# Altium schematic sheet PCI_Express.SchDoc: Ixora
size A3; Organization: Toradex AG; Address1: Altsagenstrasse 5; Address2: Horw; Address3: 6048; Address4: Switzerland; DocumentNumber: 18; Revision: V1.1; SheetNumber: 14; SheetTotal: 17; PageSetup: Record=PageOptions|CenterHorizontal=True|CenterVertical=True|PrintScale=0.73|XCorrection=1.00|YCorrection=1.00|PrintKind=0|BorderSize=5000000|LeftOffset=0|BottomOffset=0|Orientation=2|PaperLength=1000|PaperWidth=1000|Scale=100|PaperSource=7|PrintQuality=-4|MediaType=1|DitherType=10|PaperKind=A4|PrintScaleMode=1
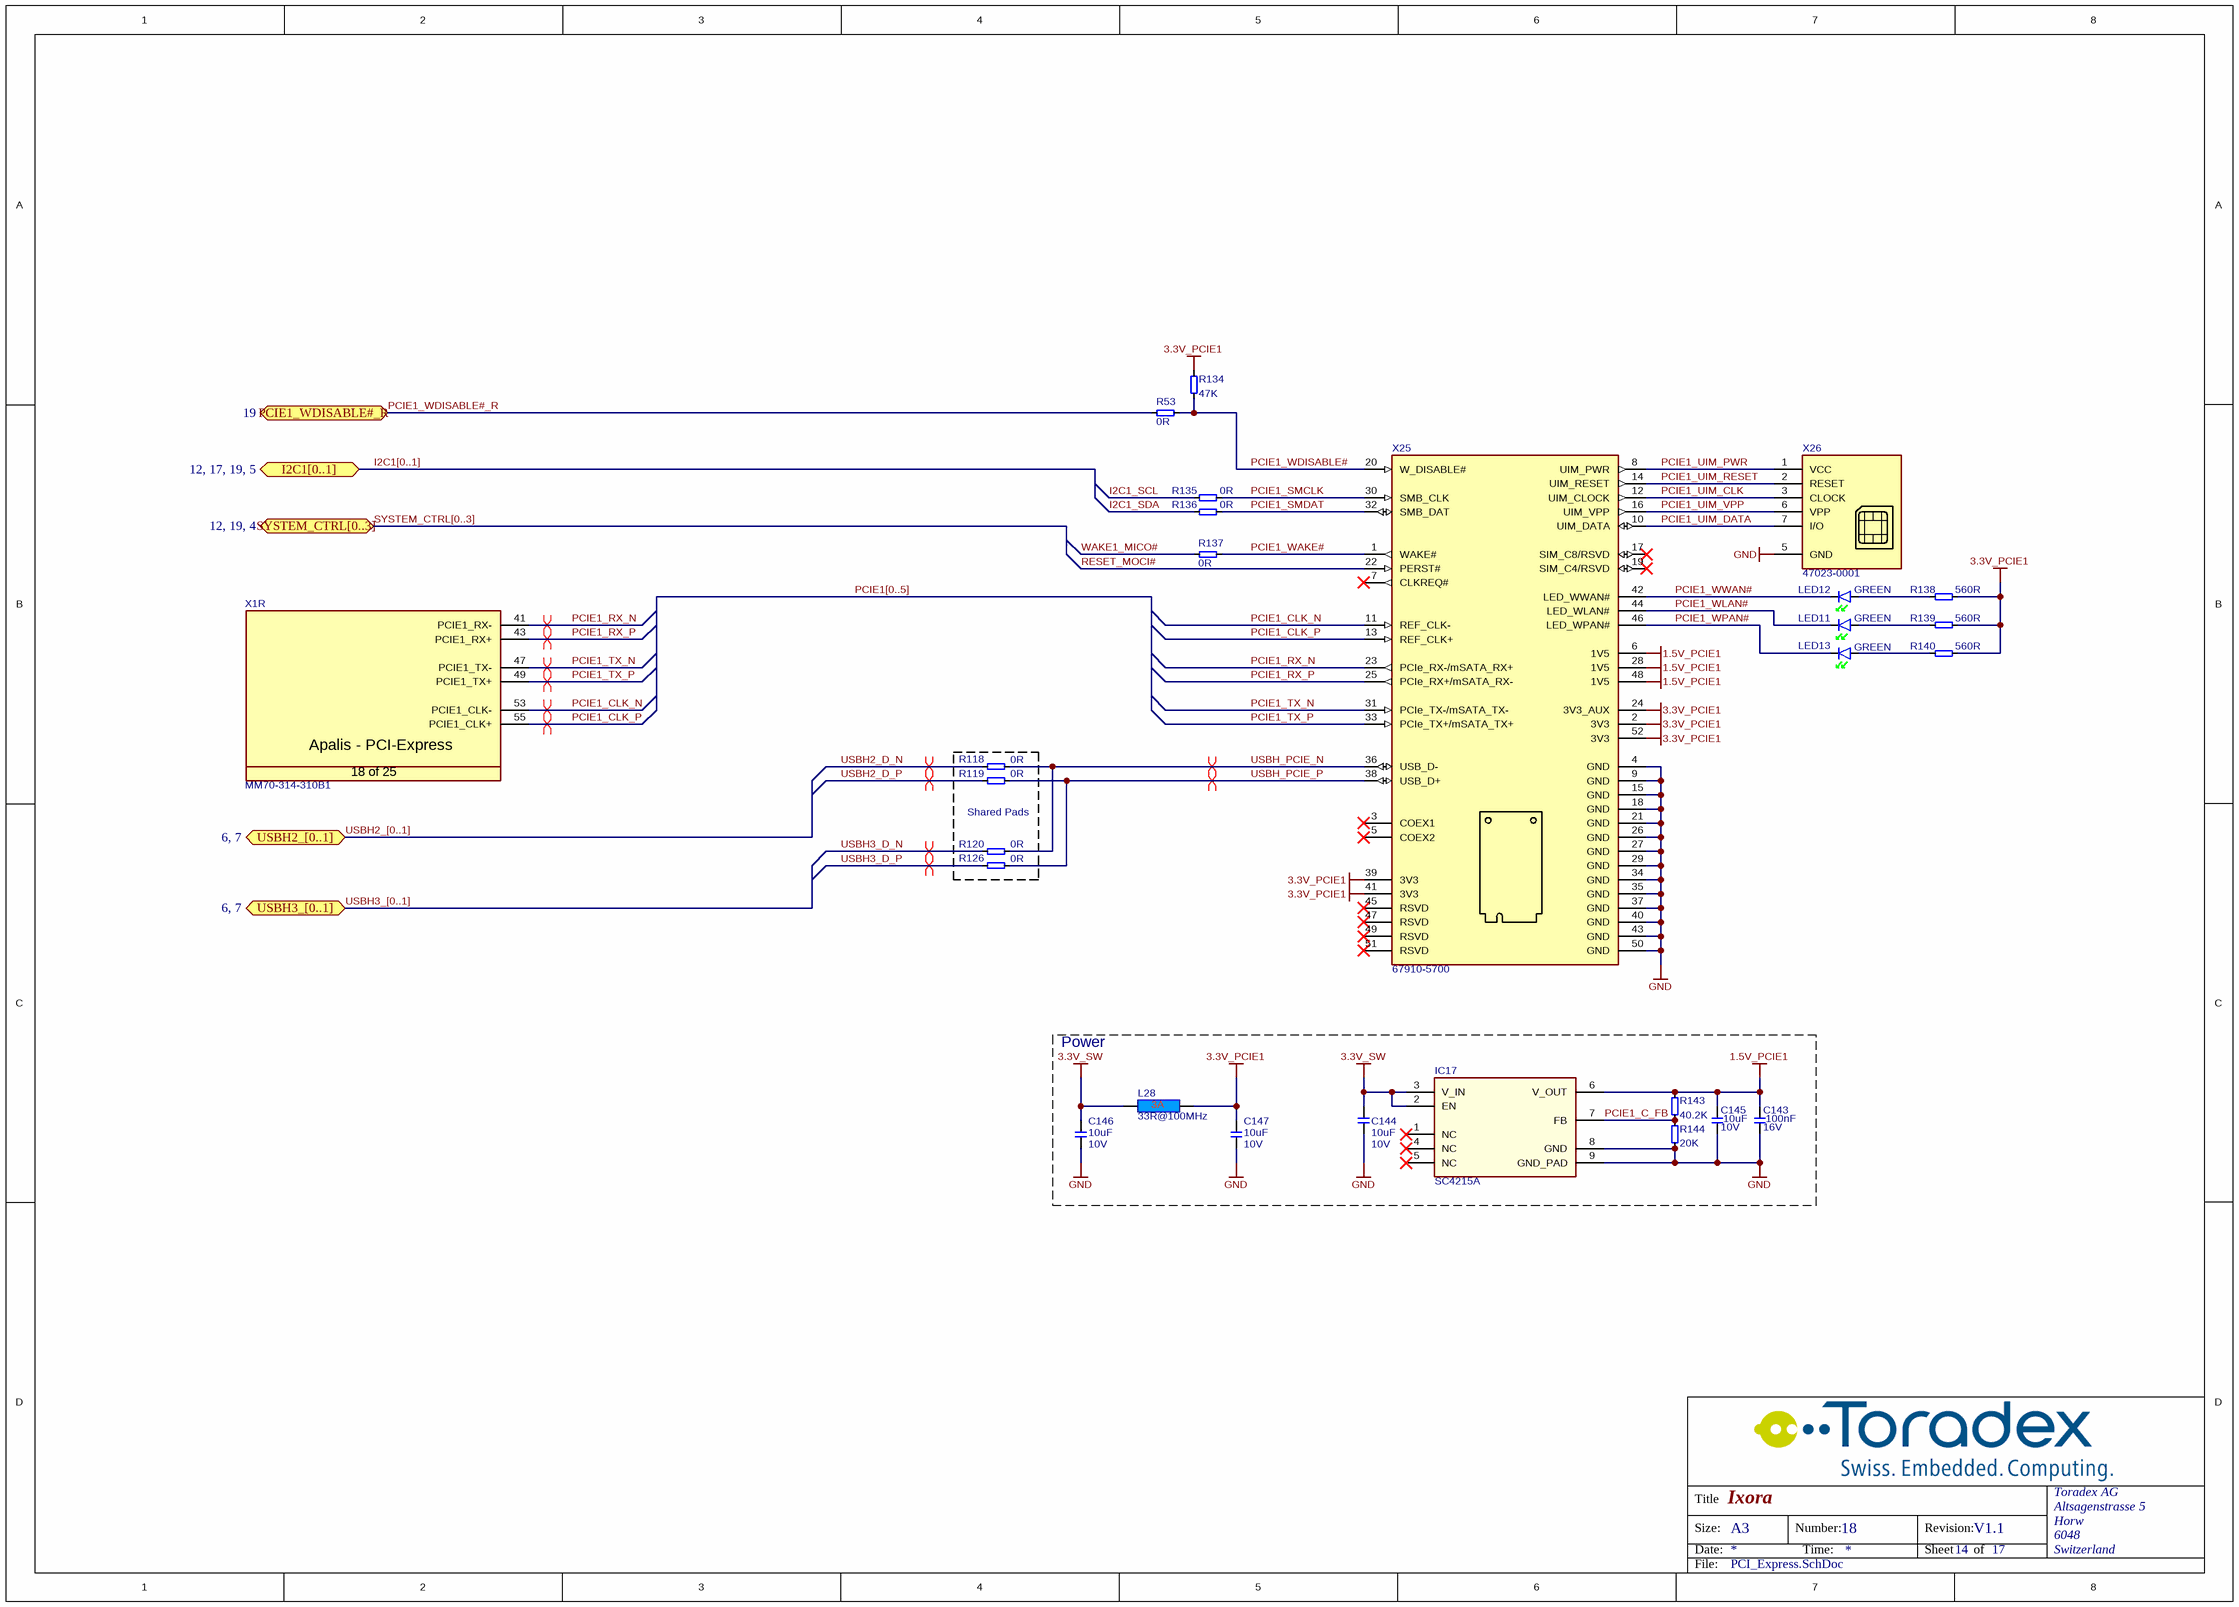
[diagram p0: PCI_Express.SchDoc]

## Parts
C143  Rating: 16V  [CAPC1005X60N]  (hidden comment: 100nF)
C144  Rating: 10V  [T_CAPC0603X33N]  (hidden comment: 10uF)
C145  Rating: 10V  [T_CAPC0603X33N]  (hidden comment: 10uF)
C146  Rating: 10V  [T_CAPC0603X33N]  (hidden comment: 10uF)
C147  Rating: 10V  [T_CAPC0603X33N]  (hidden comment: 10uF)
IC17  Manufacturer Part No.: SC4215A  [SOIC127P650X175_HS-8N]  (hidden comment: IC-Semtech-SC4215A)
L28  33R@100MHz  [INDC1608X95N]
LED11  Color: GREEN  [T_Kingbright_APA1606CGCK]  (hidden comment: APA1606CGCK)
LED12  Color: GREEN  [T_Kingbright_APA1606CGCK]  (hidden comment: APA1606CGCK)
LED13  Color: GREEN  [T_Kingbright_APA1606CGCK]  (hidden comment: APA1606CGCK)
R53  0R  [T_RESC0603X30N]
R118  0R  [T_RESC0603X30N]
R119  0R  [T_RESC0603X30N]
R120  0R  [T_RESC0603X30N]
R126  0R  [T_RESC0603X30N]
R134  47K  [T_RESC0603X30N]
R135  0R  [RESC1005X40N]
R136  0R  [RESC1005X40N]
R137  0R  [T_RESC0603X30N]
R138  560R  [RESC1005X40N]
R139  560R  [RESC1005X40N]
R140  560R  [RESC1005X40N]
R143  40.2K  [RESC1005X40N]
R144  20K  [RESC1005X40N]
X1  Manufacturer Part No.: MM70-314-310B1  [T_JAE_MM70-314-310B1]  (hidden comment: CON-JAE-MM70-314-310B1-314-0.5mm)  (part R of 25)
X25  67910-5700  [T_Molex_67910-5700]
X26  47023-0001  [T_Molex_47023-0001]

## Blocks framed on the sheet
Shared Pads: R118-R120 R126
Power: C143-C147 IC17 L28 R143 R144

## Ports
I2C1[0..1] (bidir, see 12, 17, 19, 5), PCIE1_WDISABLE#_R (bidir, see 19), SYSTEM_CTRL[0..3] (bidir, see 12, 19, 4), USBH2_[0..1] (bidir, see 6, 7), USBH3_[0..1] (bidir, see 6, 7)

## Nets
1.5V_PCIE1: C143.2 C145.2 IC17.6(V_OUT) R143.2 X25.6(1V5) X25.28(1V5) X25.48(1V5)
3.3V_PCIE1: C147.2 L28.2 R134.2 R138.1 R139.1 R140.1 X25.2(3V3) X25.24(3V3_AUX) X25.39(3V3) X25.41(3V3) X25.52(3V3)
3.3V_SW: C144.2 C146.2 IC17.2(EN) IC17.3(V_IN) L28.1
GND: C143.1 C144.1 C145.1 C146.1 C147.1 IC17.8(GND) IC17.9(GND_PAD) R144.1 X25.4(GND) X25.9(GND) X25.15(GND) X25.18(GND) X25.21(GND) X25.26(GND) X25.27(GND) X25.29(GND) X25.34(GND) X25.35(GND) X25.37(GND) X25.40(GND) X25.43(GND) X25.50(GND) X26.5(GND)
I2C1_SCL: R135.1
I2C1_SDA: R136.1
PCIE1_C_FB: IC17.7(FB) R143.1 R144.2
PCIE1_CLK_N: X1.53(PCIE1_CLK-) X25.11(REF_CLK-)
PCIE1_CLK_P: X1.55(PCIE1_CLK+) X25.13(REF_CLK+)
PCIE1_RX_N: X1.41(PCIE1_RX-) X25.23(PCIe_RX-/mSATA_RX+)
PCIE1_RX_P: X1.43(PCIE1_RX+) X25.25(PCIe_RX+/mSATA_RX-)
PCIE1_SMCLK: R135.2 X25.30(SMB_CLK)
PCIE1_SMDAT: R136.2 X25.32(SMB_DAT)
PCIE1_TX_N: X1.47(PCIE1_TX-) X25.31(PCIe_TX-/mSATA_TX-)
PCIE1_TX_P: X1.49(PCIE1_TX+) X25.33(PCIe_TX+/mSATA_TX+)
PCIE1_UIM_CLK: X25.12(UIM_CLOCK) X26.3(CLOCK)
PCIE1_UIM_DATA: X25.10(UIM_DATA) X26.7(I/O)
PCIE1_UIM_PWR: X25.8(UIM_PWR) X26.1(VCC)
PCIE1_UIM_RESET: X25.14(UIM_RESET) X26.2(RESET)
PCIE1_UIM_VPP: X25.16(UIM_VPP) X26.6(VPP)
PCIE1_WAKE#: R137.2 X25.1(WAKE#)
PCIE1_WDISABLE#: R53.1 R134.1 X25.20(W_DISABLE#)
PCIE1_WDISABLE#_R: R53.2 ; port PCIE1_WDISABLE#_R
PCIE1_WLAN#: LED11.1(K) X25.44(LED_WLAN#)
PCIE1_WPAN#: LED13.1(K) X25.46(LED_WPAN#)
PCIE1_WWAN#: LED12.1(K) X25.42(LED_WWAN#)
RESET_MOCI#: X25.22(PERST#)
USBH2_D_N: R118.1
USBH2_D_P: R119.1
USBH3_D_N: R120.1
USBH3_D_P: R126.1
USBH_PCIE_N: R118.2 R120.2 X25.36(USB_D-)
USBH_PCIE_P: R119.2 R126.2 X25.38(USB_D+)
WAKE1_MICO#: R137.1
NetLED11_2: LED11.2(A) R139.2
NetLED12_2: LED12.2(A) R138.2
NetLED13_2: LED13.2(A) R140.2

Not connected (* = marked no-connect by the designer): IC17 1(NC)* 4(NC)* 5(NC)*; X25 3(COEX1)* 5(COEX2)* 7(CLKREQ#)* 17(SIM_C8/RSVD)* 19(SIM_C4/RSVD)* 45(RSVD)* 47(RSVD)* 49(RSVD)* 51(RSVD)*

## Buses and harness runs
bus I2C1[0..1] = port I2C1[0..1]
bus PCIE1[0..5]
bus SYSTEM_CTRL[0..3] = port SYSTEM_CTRL[0..3]
bus USBH2_[0..1] = port USBH2_[0..1]
bus USBH3_[0..1] = port USBH3_[0..1]

## Layout directives
differential pair: PCIE1_CLK_N, PCIE1_CLK_P, PCIE1_RX_N, PCIE1_RX_P, PCIE1_TX_N, PCIE1_TX_P, USBH2_D_N, USBH2_D_P, USBH3_D_N, USBH3_D_P, USBH_PCIE_N, USBH_PCIE_P

## Notes on the sheet
- Title
- Size:
- Date:
- A3
- Number:
- Time:
- Revision:
- Sheet
- of
- File:
- (in symbol CON-JAE-MM70-314-310B1-314-0.5mm, part R) Apalis - PCI-Express; 18 of 25

## Library data of the parts
C143 = C-X7R-100nF-16V-10%-0402: Capacitor Ceramic X7R 100nF 16V 10% 0402; Tolerance: 10%; Type: X7R; Value: 100nF
C144-C147 = C-X5R-10uF-10V-20%-0603: Capacitor Ceramic X5R 10uF 10V 20% 0603; Tolerance: 20%; Type: X5R; Value: 10uF
IC17 = IC-Semtech-SC4215A: LDO TO 2A; Manufacturer Name: Semtech
L28 = L-33R@100MHz-3A-25%-0603: 33R@100MHz 3A EMI FILTER; Tolerance: 25%; Rating: 3A; Value: 33R@100MHz
LED11-LED13 = LED-Kingbright-APA1606CGCK: LED green Kingbright APA1606CGCK; Manufacturer Name: Kingbright; Manufacturer Part No.: APA1606CGCK
R53 R118-R120 R126 R137 = R-0R-63mW-1%-0603: Resistor 0 ohm 63mW 1% 0603; Rating: 63mW; Tolerance: 1%; Value: 0R
R134 = R-47KR-63mW-5%-0603: Resistor 47 Kohm 63mW 5% 0603; Value: 47KR; Rating: 63mW; Tolerance: 5%
R135 R136 = R-0R-63mW-1%-0402: Resistor 0 ohm 63mW 1% 0402; Rating: 63mW; Tolerance: 1%; Value: 0R
R138-R140 = R-560R-63mW-5%-0402: Resistor 560 ohm 63mW 5% 0402; Rating: 63mW; Tolerance: 5%; Value: 560R
R143 = R-40.2KR-63mW-1%-0402: Resistor 40.2 Kohm 63mW 1% 0402; Value: 40.2KR; Rating: 63mW; Tolerance: 1%
R144 = R-20KR-63mW-1%-0402: Resistor 20 Kohm 63mW 1% 0402; Value: 20KR; Rating: 63mW; Tolerance: 1%
X1 = CON-JAE-MM70-314-310B1-314-0.5mm: MXM3 Connector; Manufacturer Name: JAE; No. of ways: 314
X25 = CON-Molex-67910-5700: PCIe_Mini Card Holder; Manufacturer Name: Molex; Part No.: 67910-5700
X26 = CON-Molex-47023-0001: 6 Contacts Mini Sim Card Holder; Manufacturer Name: Molex; Part No.: 47023-0001